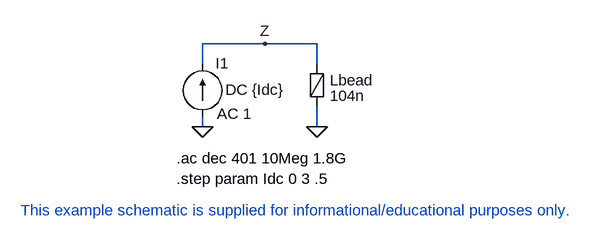
[diagram p0: schematic FerriteBead_Z(I).asc]
FerriteBead_Z(I).asc, the LTspice schematic file:
Version 4
SHEET 1 1656 1480
WIRE -1072 -1104 -1168 -1104
WIRE -992 -1104 -1072 -1104
WIRE -1168 -1072 -1168 -1104
WIRE -992 -1072 -992 -1104
WIRE -1168 -976 -1168 -992
WIRE -992 -976 -992 -1008
FLAG -1168 -976 0
FLAG -1072 -1104 Z
FLAG -992 -976 0
SYMBOL current -1168 -992 R180
WINDOW 123 -22 4 Right 0
WINDOW 39 0 0 Left 0
WINDOW 0 -20 82 Right 0
WINDOW 3 -35 41 Right 0
SYMATTR Value2 AC 1
SYMATTR InstName I1
SYMATTR Value DC {Idc}
SYMBOL FerriteBead -992 -1040 R0
SYMATTR InstName Lbead
SYMATTR Value 104n
SYMATTR SpiceLine Ipk=0.3 Rser=0.25 Rpar=85 Cpar=212f
TEXT -1208 -928 Left 0 !.ac dec 401 10Meg 1.8G
TEXT -1208 -896 Left 0 !.step param Idc 0 3 .5
TEXT -1448 -848 Left 0 ;This example schematic is supplied for informational/educational purposes only.

The netlist it stands for:
* FerriteBead_Z(I).asc
I1 0 Z DC {Idc} AC 1
Lbead Z 0 104n Ipk=0.3 Rser=0.25 Rpar=85 Cpar=212f
.ac dec 401 10Meg 1.8G
.step param Idc 0 3 .5
* This example schematic is supplied for informational/educational purposes only.
.backanno
.end